# Altium schematic sheet [03] - Majority Trigger.SchDoc
size A4; Address1: III. Physikalisches Institut B; Address2: RWTH Aachen University; Address3: Otto-Blumenthal-Strasse; Address4: 52074 Aachen, GERMANY; DocumentNumber: 4; SheetNumber: 4; SheetTotal: 6
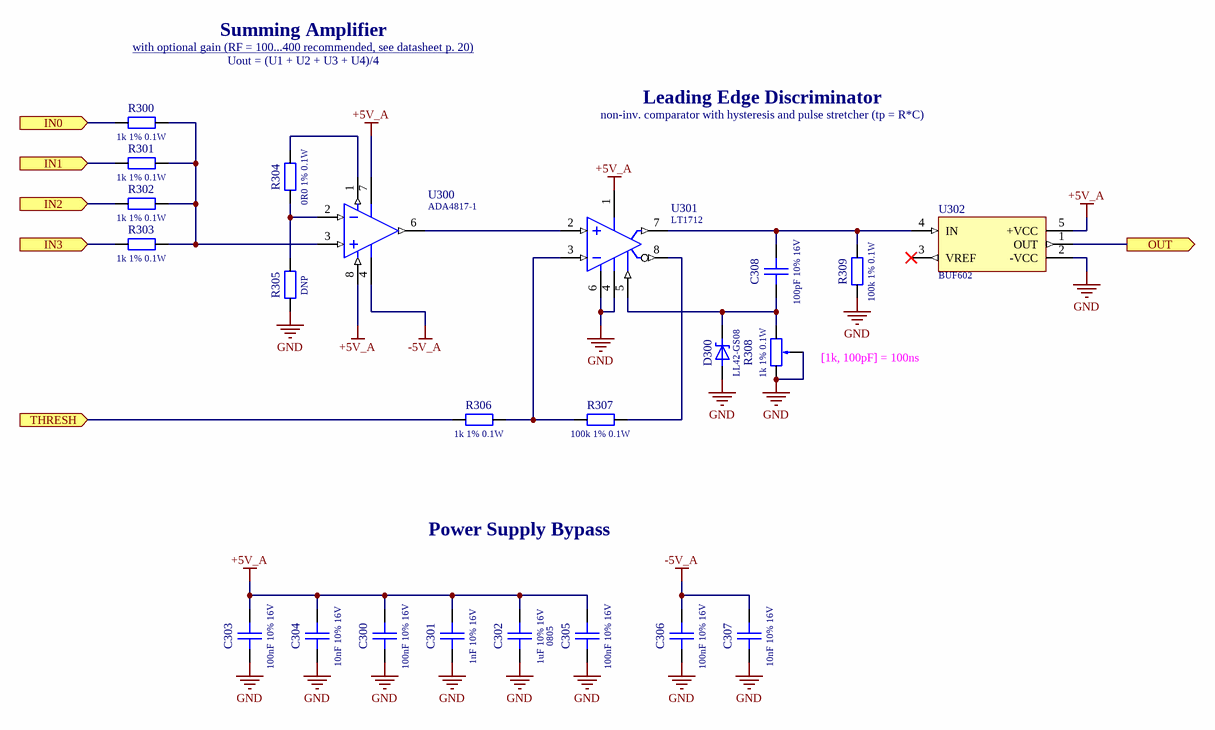
[diagram p0: [03] - Majority Trigger.SchDoc]

## Parts
C300  100nF 10% 16V  [0603_CAP]
C301  1nF 10% 16V  [0603_CAP]
C302  PackageReference: 0805  [0805_CAP]  (hidden comment: 1uF 10% 16V)
C303  100nF 10% 16V  [0603_CAP]
C304  10nF 10% 16V  [0603_CAP]
C305  100nF 10% 16V  [0603_CAP]
C306  100nF 10% 16V  [0603_CAP]
C307  10nF 10% 16V  [0603_CAP]
C308  100pF 10% 16V  [0603_CAP]
D300  LL42-GS08  [MiniMELF]
R300  1k 1% 0.1W  [0603_RES]
R301  1k 1% 0.1W  [0603_RES]
R302  1k 1% 0.1W  [0603_RES]
R303  1k 1% 0.1W  [0603_RES]
R304  0R0 1% 0.1W  [0603_RES]
R305  DNP  [0603_RES]
R306  1k 1% 0.1W  [0603_RES]
R307  100k 1% 0.1W  [0603_RES]
R308  1k 1% 0.1W  [3224W]
R309  100k 1% 0.1W  [0603_RES]
U300  ADA4817-1  [SOIC_8]
U301  LT1712  [MSOP-8]
U302  BUF602  [SOT-23-5]

## Ports
IN0 (in), IN1 (in), IN2 (in), IN3 (in), OUT (out), THRESH (in)

## Nets
+5V_A: C300.2 C301.2 C302.2 C303.2 C304.2 C305.2 U300.7(+VS) U300.8(~{PD}) U301.1(+V) U302.5(+VCC)
-5V_A: C306.2 C307.2 U300.4(-VS)
GND: C300.1 C301.1 C302.1 C303.1 C304.1 C305.1 C306.1 C307.1 D300.2(A) R305.2 R308.1(CCW) R308.2(WIPER) R309.2 U301.4(-V) U301.6(GND) U302.2(-VCC)
IN0: R300.2 ; port IN0
IN1: R301.2 ; port IN1
IN2: R302.2 ; port IN2
IN3: R303.2 ; port IN3
OUT: U302.1(OUT) ; port OUT
THRESH: R306.2 ; port THRESH
NetC308_1: C308.1 D300.1(K) R308.3(CW) U301.5(LE)
NetC308_2: C308.2 R309.1 U301.7(Q) U302.4(IN)
NetR300_1: R300.1 R301.1 R302.1 R303.1 U300.3(IN+)
NetR304_1: R304.1 U300.1(FB)
NetR304_2: R304.2 R305.1 U300.2(IN-)
NetR306_1: R306.1 R307.2 U301.3(-IN)
NetR307_1: R307.1 U301.8(~{Q})
NetU300_6: U300.6(OUT) U301.2(+IN)

Not connected (* = marked no-connect by the designer): U302 3(VREF)*

## Notes on the sheet
- Summing Amplifier
- with optional gain (RF = 100...400 recommended, see datasheet p. 20) <https://www.analog.com/media/en/technical-documentation/data-sheets/ADA4817-1_4817-2.pdf>
- Uout = (U1 + U2 + U3 + U4)/4
- Leading Edge Discriminator
- non-inv. comparator with hysteresis and pulse stretcher (tp = R*C)
- (near R308) [1k, 100pF] = 100ns
- Power Supply Bypass
- TITLE
- REVISION
- PROJECT
- AUTHOR
- DESC.
- DATE
- SHEET
- OF

## Library data of the parts
C300-C308 = Capacitor: Simple generic capacitor.
  C300 C303 C305 C306: PackageReference: 0603; Value: 100nF 10% 16V
  C301: PackageReference: 0603; Value: 1nF 10% 16V
  C302: Value: 1uF 10% 16V
  C304 C307: PackageReference: 0603; Value: 10nF 10% 16V
  C308: PackageReference: 0603; Value: 100pF 10% 16V
D300 = Schottky Diode: Simple schottky diode.; Manufacturer: Vishay; PackageReference: MiniMELF; PartNumber: LL42-GS08; Value: LL42-GS08
R300-R307 R309 = Resistor: Simple generic resistor.; PackageReference: 0603
  R300-R303 R306: Value: 1k 1% 0.1W
  R304: Value: 0R0 1% 0.1W
  R305: Value: DNP
  R307 R309: Value: 100k 1% 0.1W
R308 = Potentiometer: Simple generic potentiometer.; Value: 1k 1% 0.1W
U300 = ADA4817-1: Low Noise, 1 GHz FastFET Op Amps; Manufacturer: Analog Devices; PackageReference: SO-8; Value: ADA4817-1
U301 = LT1712: Single/Dual 4.5ns, 3V/5V/±5V, Rail-to-Rail Comparators; Manufacturer: Analog Devices; PartNumber: LT1712CGN; PackageReference: SSOP-16; Supplier1: Digi-Key; Supplier1PartNumber: LT1712CGN#PBF-ND; Supplier1Link: https://www.digikey.de/product-detail/de/linear-technology-analog-devices/LT1712CGN-PBF/LT1712CGN-PBF-ND/961051; Value: LT1712
U302 = BUF602: High-Speed, Closed-Loop Buffer.; Manufacturer: Texas Instruments; PartNumber: BUF602IDBVT; PackageReference: SOT-23-5; Value: BUF602